# Altium schematic sheet SENSORS.SchDoc
size Tabloid; SheetNumber: 15; SheetTotal: 25; Sheet_Name: MECHANICAL; Size: 11x17
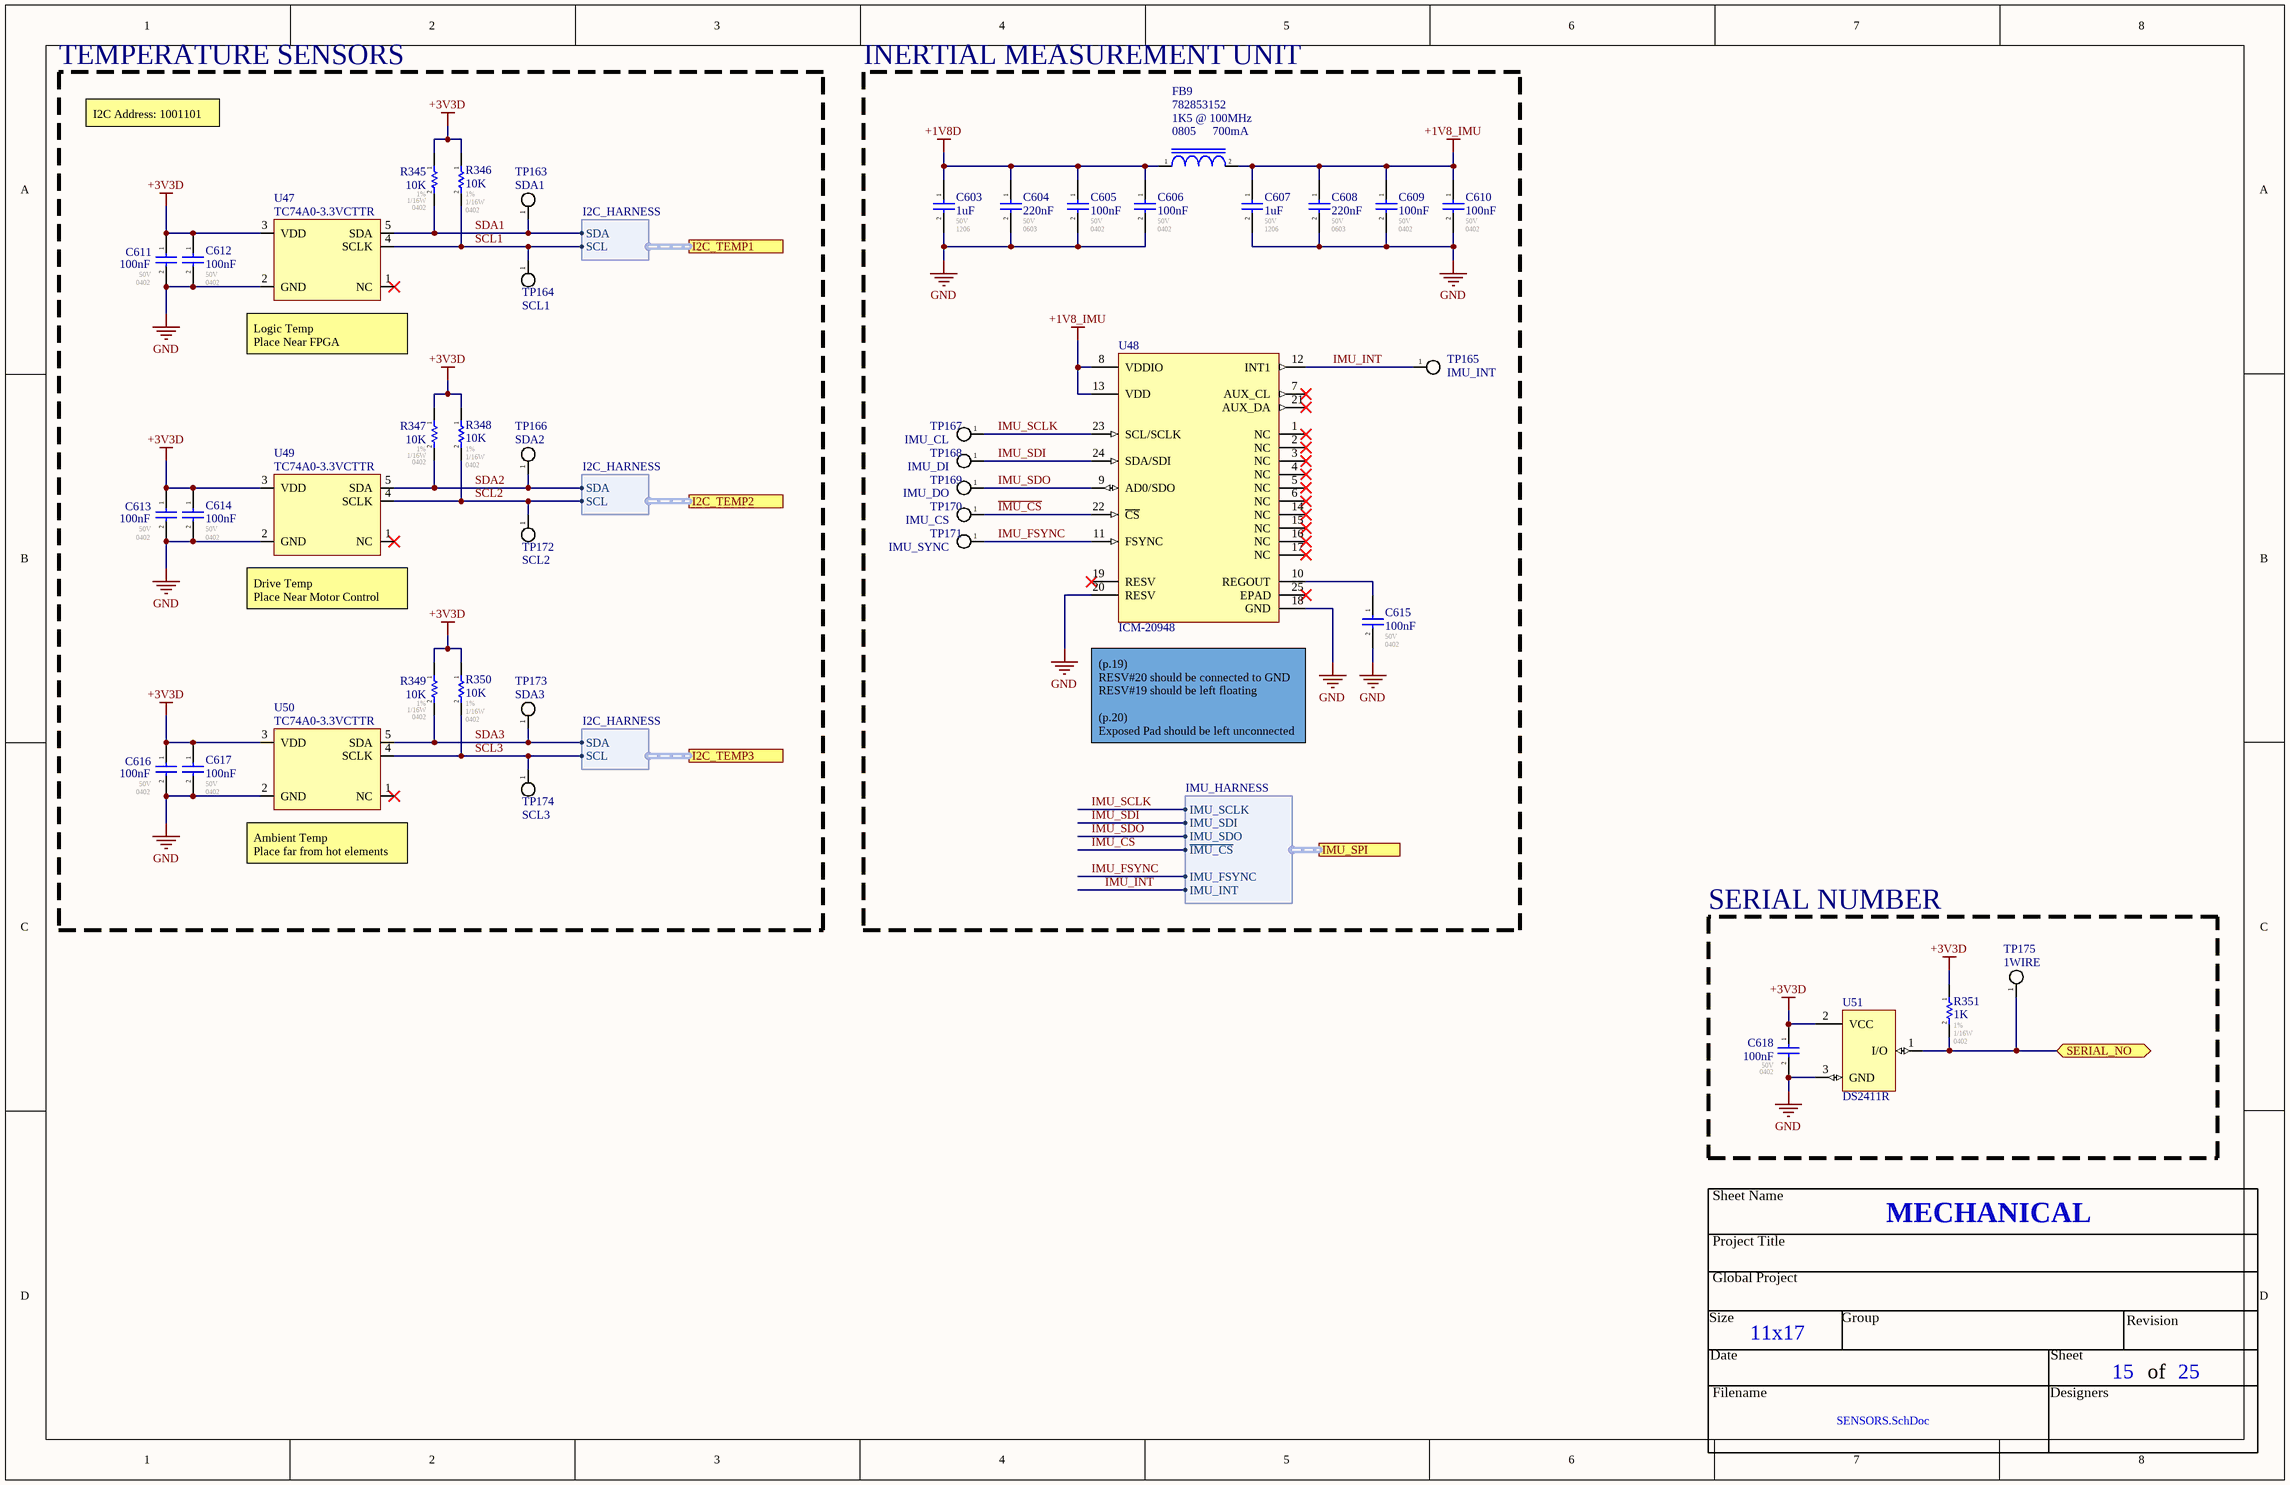
[diagram p0: SENSORS.SchDoc]

## Parts
C603  1uF  Voltage - Rated: 50V  Footprint: 1206  [CAP_1206]
C604  220nF  Voltage - Rated: 50V  Footprint: 0603  [CAP_0603]
C605  100nF  Voltage - Rated: 50V  Footprint: 0402  [CAP_0402]
C606  100nF  Voltage - Rated: 50V  Footprint: 0402  [CAP_0402]
C607  1uF  Voltage - Rated: 50V  Footprint: 1206  [CAP_1206]
C608  220nF  Voltage - Rated: 50V  Footprint: 0603  [CAP_0603]
C609  100nF  Voltage - Rated: 50V  Footprint: 0402  [CAP_0402]
C610  100nF  Voltage - Rated: 50V  Footprint: 0402  [CAP_0402]
C611  100nF  Voltage - Rated: 50V  Footprint: 0402  [CAP_0402]
C612  100nF  Voltage - Rated: 50V  Footprint: 0402  [CAP_0402]
C613  100nF  Voltage - Rated: 50V  Footprint: 0402  [CAP_0402]
C614  100nF  Voltage - Rated: 50V  Footprint: 0402  [CAP_0402]
C615  100nF  Voltage - Rated: 50V  Footprint: 0402  [CAP_0402]
C616  100nF  Voltage - Rated: 50V  Footprint: 0402  [CAP_0402]
C617  100nF  Voltage - Rated: 50V  Footprint: 0402  [CAP_0402]
C618  100nF  Voltage - Rated: 50V  Footprint: 0402  [CAP_0402]
FB9  782853152  Impedance @ Freq: 1K5 @ 100MHz  Package / Case: 0805  Current Rating: 700mA  [IND_0805]
R345  10K  Tolerance: 1%  Power: 1/16W  Package / Case: 0402  [RES_0402]
R346  10K  Tolerance: 1%  Power: 1/16W  Package / Case: 0402  [RES_0402]
R347  10K  Tolerance: 1%  Power: 1/16W  Package / Case: 0402  [RES_0402]
R348  10K  Tolerance: 1%  Power: 1/16W  Package / Case: 0402  [RES_0402]
R349  10K  Tolerance: 1%  Power: 1/16W  Package / Case: 0402  [RES_0402]
R350  10K  Tolerance: 1%  Power: 1/16W  Package / Case: 0402  [RES_0402]
R351  1K  Tolerance: 1%  Power: 1/16W  Package / Case: 0402  [RES_0402]
TP163  SDA1  [TP_PAD_SMALL]  (no BOM)
TP164  SCL1  [TP_PAD_SMALL]  (no BOM)
TP165  IMU_INT  [TP_PAD_SMALL]  (no BOM)
TP166  SDA2  [TP_PAD_SMALL]  (no BOM)
TP167  IMU_CL  [TP_PAD_SMALL]  (no BOM)
TP168  IMU_DI  [TP_PAD_SMALL]  (no BOM)
TP169  IMU_DO  [TP_PAD_SMALL]  (no BOM)
TP170  IMU_CS  [TP_PAD_SMALL]  (no BOM)
TP171  IMU_SYNC  [TP_PAD_SMALL]  (no BOM)
TP172  SCL2  [TP_PAD_SMALL]  (no BOM)
TP173  SDA3  [TP_PAD_SMALL]  (no BOM)
TP174  SCL3  [TP_PAD_SMALL]  (no BOM)
TP175  1WIRE  [TP_PAD_SMALL]  (no BOM)
U47  TC74A0-3.3VCTTR  [SEN_TEMP_TC74A0-3.3VCTTR]
U48  ICM-20948  [QFN-24_3X3]
U49  TC74A0-3.3VCTTR  [SEN_TEMP_TC74A0-3.3VCTTR]
U50  TC74A0-3.3VCTTR  [SEN_TEMP_TC74A0-3.3VCTTR]
U51  DS2411R  [SOT23-3]

## Blocks framed on the sheet
TEMPERATURE SENSORS: C611-C614 C616 C617 R345-R350 TP163 TP164 TP166 TP172-TP174 U47 U49 U50
INERTIAL MEASUREMENT UNIT: C603-C610 C615 FB9 TP165 TP167-TP171 U48
SERIAL NUMBER: C618 R351 TP175 U51

## Ports
I2C_TEMP1 (harness I2C_HARNESS), I2C_TEMP2 (harness I2C_HARNESS), I2C_TEMP3 (harness I2C_HARNESS), IMU_SPI (harness IMU_HARNESS), SERIAL_NO (bidir)

## Harnesses
I2C_HARNESS: SDA, SCL
IMU_HARNESS: IMU_SCLK, IMU_SDI, IMU_SDO, ~{IMU_CS}, IMU_FSYNC, IMU_INT

## Nets
+1V8_IMU: C607.1 C608.1 C609.1 C610.1 FB9.2 U48.8(VDDIO) U48.13(VDD)
+1V8D: C603.1 C604.1 C605.1 C606.1 FB9.1
+3V3D: C611.1 C612.1 C613.1 C614.1 C616.1 C617.1 C618.1 R345.1 R346.1 R347.1 R348.1 R349.1 R350.1 R351.1 U47.3(VDD) U49.3(VDD) U50.3(VDD) U51.2(VCC)
GND: C603.2 C604.2 C605.2 C606.2 C607.2 C608.2 C609.2 C610.2 C611.2 C612.2 C613.2 C614.2 C615.2 C616.2 C617.2 C618.2 U47.2(GND) U48.18(GND) U48.20(RESV) U49.2(GND) U50.2(GND) U51.3(GND)
~{IMU_CS}: TP170.1(A) U48.22(~{CS}) ; port IMU_SPI.~{IMU_CS}
IMU_FSYNC: TP171.1(A) U48.11(FSYNC) ; port IMU_SPI.IMU_FSYNC
IMU_INT: TP165.1(A) U48.12(INT1) ; port IMU_SPI.IMU_INT
IMU_SCLK: TP167.1(A) U48.23(SCL/SCLK) ; port IMU_SPI.IMU_SCLK
IMU_SDI: TP168.1(A) U48.24(SDA/SDI) ; port IMU_SPI.IMU_SDI
IMU_SDO: TP169.1(A) U48.9(AD0/SDO) ; port IMU_SPI.IMU_SDO
SCL1: R346.2 TP164.1(A) U47.4(SCLK) ; port I2C_TEMP1.SCL
SCL2: R348.2 TP172.1(A) U49.4(SCLK) ; port I2C_TEMP2.SCL
SCL3: R350.2 TP174.1(A) U50.4(SCLK) ; port I2C_TEMP3.SCL
SDA1: R345.2 TP163.1(A) U47.5(SDA) ; port I2C_TEMP1.SDA
SDA2: R347.2 TP166.1(A) U49.5(SDA) ; port I2C_TEMP2.SDA
SDA3: R349.2 TP173.1(A) U50.5(SDA) ; port I2C_TEMP3.SDA
SERIAL_NO: R351.2 TP175.1(A) U51.1(I/O) ; port SERIAL_NO
NetC615_1: C615.1 U48.10(REGOUT)

Not connected (* = marked no-connect by the designer): U47 1(NC)*; U48 1(NC)* 2(NC)* 3(NC)* 4(NC)* 5(NC)* 6(NC)* 7(AUX_CL)* 14(NC)* 15(NC)* 16(NC)* 17(NC)* 19(RESV)* 21(AUX_DA)* 25(EPAD)*; U49 1(NC)*; U50 1(NC)*

## Notes on the sheet
- I2C Address: 1001101
- (near U47) Logic Temp
  Place Near FPGA
- (near U49) Drive Temp
  Place Near Motor Control
- (near U48) (p.19)
  RESV#20 should be connected to GND
  RESV#19 should be left floating
  (p.20)
  Exposed Pad should be left unconnected
- (near U50) Ambient Temp
  Place far from hot elements
- Sheet Name
- Project Title
- Global Project
- Revision
- Size
- Date
- Group
- Sheet
- of
- Filename
- Designers

## Library data of the parts
C603 C607 = CAP_CER: GCJ31CR71H105KA12L / 1206 1uF 10% X7R Ceramic Capacitor; Mfr: Murata; Operating Temperature: -55C - 125C; Temperature Coefficient: X7R; ComponentLink1Description: Digikey; ComponentLink1URL: [Digikey Link]; Part#: GCJ31CR71H105KA12L; ComponentLink2Description: Datasheet; ComponentLink2URL: [Datasheet Link]; Tolerance: 10%; Ratings: AEC-Q200
C604 C608 = CAP_CER: GCM188R71H224KA64D / 0603 220nF 10% X7R Ceramic Capacitor; Mfr: Murata; Operating Temperature: -55C - 125C; Temperature Coefficient: X7R; ComponentLink1Description: Digikey; ComponentLink1URL: [Digikey Link]; Part#: GCM188R71H224KA64D; ComponentLink2Description: Datasheet; ComponentLink2URL: [Datasheet Link]; Tolerance: 10%; Ratings: AEC-Q200
C605 C606 C609-C618 = CAP_CER: GCM155R71H104KE02J / 0402 100nF 10% X7R Ceramic Capacitor; Mfr: Murata; Operating Temperature: -55C - 125C; Temperature Coefficient: X7R; ComponentLink1Description: Digikey; ComponentLink1URL: [Digikey Link]; Part#: GCM155R71H104KE02J; ComponentLink2Description: Datasheet; ComponentLink2URL: [Datasheet Link]; Tolerance: 10%; Ratings: AEC-Q200
FB9 = FERRITE_BEAD: 600 Ohms @ 100 MHz 1 Signal Line Ferrite Bead 0603 (1608 Metric) 1A 200mOhm; Manufacturer: Wurth Elektronik; Resistance: 350mR; Operating Temperature: -55C - 125C; Rating: AEC-Q200; ComponentLink1Description: Digikey; ComponentLink1URL: https://www.digikey.ca/en/products/detail/w%C3%BCrth-elektronik/782853152/5168812; ComponentLink3Description: Octopart; ComponentLink3URL: https://octopart.com/782853152-wurth+elektronik-56466774?r=sp; ComponentLink5Description: Datasheet; ComponentLink5URL: https://www.we-online.com/en/components/products/datasheet/782853152.pdf
R345-R351 = RESISTOR: Automotive: AEC-Q200; Operating Temperature: *; # Digikey: *; ComponentLink1Description: Digikey; ComponentLink1URL: *; # Manufacturer: *
TP163-TP175 = TESTPOINT_PAD_SMALL: Test Point
U47 U49 U50 = SENS_TEMP_TC74A0-3.3VCTTR: SENS - TEMPERATURE SENSOR I2C/SMBUS - SOT23-5; Voltage: 2.7 V ~ 5.5 V; Mfg: Microchip; Precision: ±2°C (±3°C); Current: *; Power: *; Mfg Part Number: TC74A0-3.3VCTTR; HelpURL: http://ww1.microchip.com/downloads/en/DeviceDoc/21462D.pdf; CreatedBy: Jonathan Bouchard; Temperature: -40°C ~ 125°C; Value: *; Package: SOT23-5; Supplier 1: Digikey; Supplier Part Number 1: TC74A0-3.3VCTDKR-ND
U48 = ICM-20948: Accelerometer, Gyroscope, Magnetometer, 9 Axis Sensor I2C, SPI Output; Mfr: TDK InvenSense; Supply Voltage - Core: 1.8V - 3.3V; Supply Voltage - IO: 1.8V; Operating Temperature: -40C - 85C; Output Type: I2C, SPI; ComponentLink1Description: Digikey; ComponentLink1URL: https://www.digikey.ca/en/products/detail/tdk-invensense/icm-20948/6623535; ComponentLink2Description: Datasheet; ComponentLink2URL: https://invensense.tdk.com/wp-content/uploads/2016/06/DS-000189-ICM-20948-v1.3.pdf?ref_disty=digikey; ComponentLink3Description: Mfr; ComponentLink3URL: https://invensense.tdk.com/products/motion-tracking/9-axis/icm-20948/; ComponentLink4Description: Octopart; ComponentLink4URL: https://octopart.com/icm-20948-invensense-73011870?r=sp; Supplier 1: Mouser; Supplier Part Number 1: 410-ICM-20948
U51 = DS2411R: Silicon Serial Number SOT-23-3; Mfr: Analog Devices; Standyby Current: < 1µA; Serial Number: 48-bits